# Altium project Li-IonBatteryManager.PrjPcb
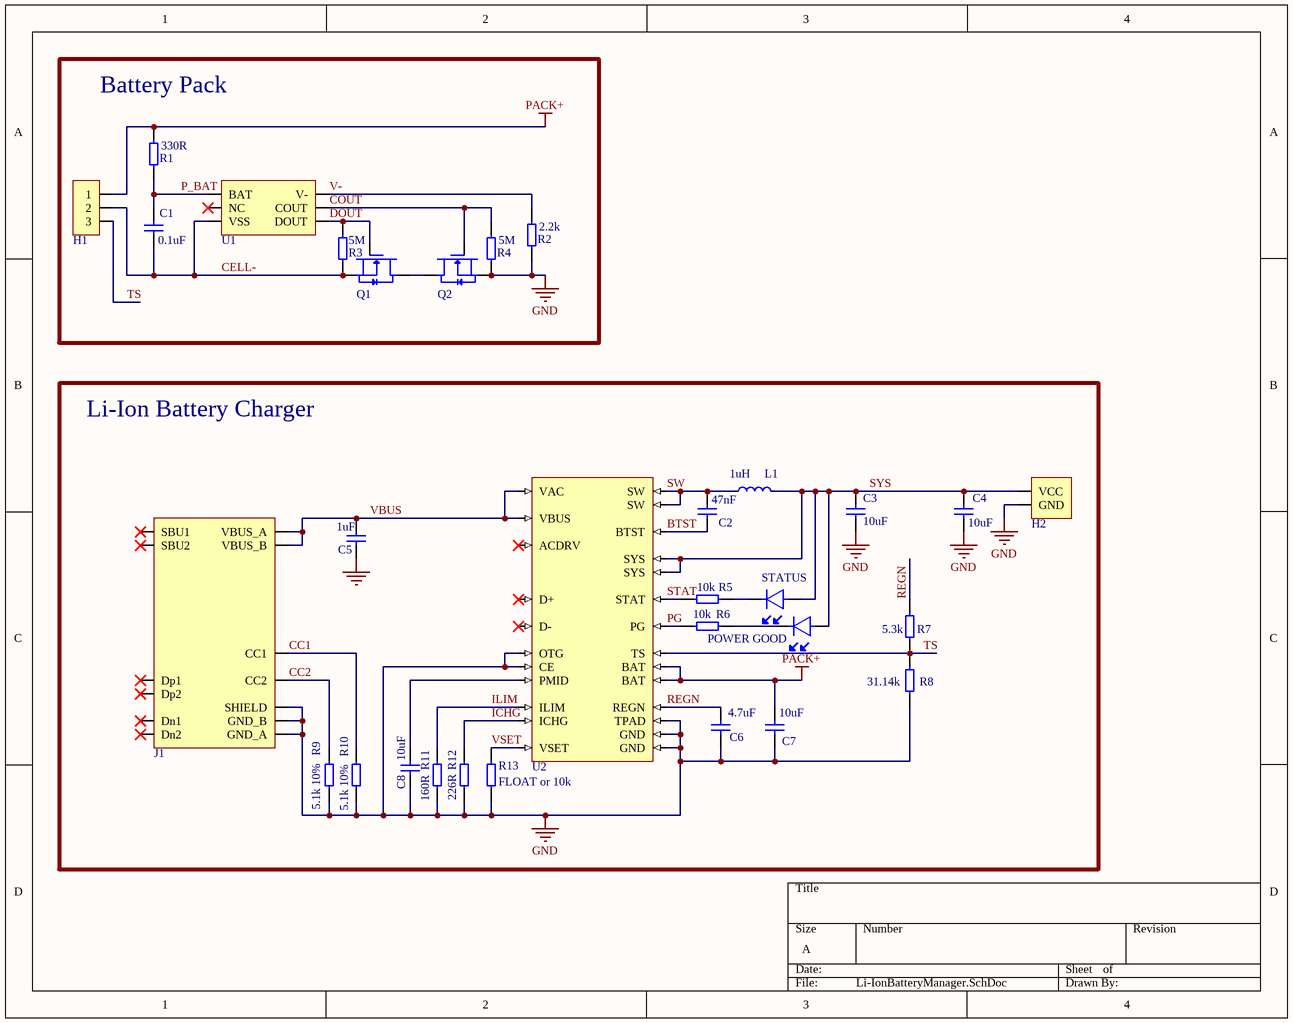
[diagram p0: Li-IonBatteryManager.SchDoc]
1 sheet, 31 parts. Net scope: global (net labels, ports and power ports of the same name join across sheets).
Board file: Li-IonBatteryManager.PcbDoc

## Sheet Li-IonBatteryManager.SchDoc
size A; SheetNumber: 1; SheetTotal: 1

### Parts
C1  0.1uF  [0603 Capacitor]
C2  47nF  [0603 Capacitor]
C3  10uF  [0603 Capacitor]
C4  10uF  [0603 Capacitor]
C5  1uF  [0603 Capacitor]
C6  4.7uF  [0603 Capacitor]
C7  10uF  [0603 Capacitor]
C8  10uF  [0603 Capacitor]
D1  STATUS  [0603 LED]
D2  POWER GOOD  [0603 LED]
H1  22-05-7035  [Molex Header 3]  (value not drawn)
H2  Header 2x1  [HEADER 2x1]  (value not drawn)
J1  2137160001  [USB TYPE C Molex]  (value not drawn)
L1  1uH  [SRP2510A]
Q1  CSD16406Q3  [CSD16406Q3]  (value not drawn)
Q2  CSD16406Q3  [CSD16406Q3]  (value not drawn)
R1  330R  [0603 Resistor]
R2  2.2k  [0603 Resistor]
R3  5M  [0603 Resistor]
R4  5M  [0603 Resistor]
R5  10k  [0603 Resistor]
R6  10k  [0603 Resistor]
R7  5.3k  [0603 Resistor]
R8  31.14k  [0603 Resistor]
R9  5.1k 10%  [0603 Resistor]
R10  5.1k 10%  [0603 Resistor]
R11  160R  [0603 Resistor]
R12  226R  [0603 Resistor]
R13  FLOAT or 10k  [0603 Resistor]
U1  BQ29700DSET  [BQ297xx]  (value not drawn)
U2  BQ25616JRTWR  [BQ25616]  (value not drawn)

### Blocks framed on the sheet
Battery Pack: C1 H1 Q1 Q2 R1-R4 U1
Li-Ion Battery Charger: C2-C8 D1 D2 H2 J1 L1 R5-R13 U2

### Nets
GND: C3.1 C4.1 C5.1 C6.1 C7.1 C8.1 H2.2(GND) J1.A1(GND_A) J1.B1(GND_B) J1.SHIELD Q2.1 R2.1 R4.1 R8.1 R9.1 R10.1 R11.1 R12.1 R13.1 U2.6(OTG) U2.9(CE) U2.17(GND) U2.18(GND) U2.25(TPAD)
PACK+: C7.2 H1.1 R1.2 U2.13(BAT) U2.14(BAT)
BTST: C2.1 U2.21(BTST)
CC1: J1.A5(CC1) R10.2
CC2: J1.B5(CC2) R9.2
CELL-: C1.1 H1.2 Q1.1 R3.1 U1.4(VSS)
COUT: Q2.4 R4.2 U1.2(COUT)
DOUT: Q1.4 R3.2 U1.3(DOUT)
ICHG: R12.2 U2.10(ICHG)
ILIM: R11.2 U2.8(ILIM)
P_BAT: C1.2 R1.1 U1.5(BAT)
PG: R6.1 U2.7(PG)
REGN: C6.2 R7.2 U2.22(REGN)
STAT: R5.1 U2.5(STAT)
SW: C2.2 L1.1 U2.19(SW) U2.20(SW)
SYS: C3.2 C4.2 D1.1 D2.1 H2.1(VCC) L1.2 U2.15(SYS) U2.16(SYS)
TS: H1.3 R7.1 R8.2 U2.11(TS)
V-: R2.2 U1.6(V-)
VBUS: C5.2 J1.A4(VBUS_A) J1.B4(VBUS_B) U2.1(VAC) U2.24(VBUS)
VSET: R13.2 U2.12(VSET)
NetC8_2: C8.2 U2.23(PMID)
NetD1_2: D1.2 R5.2
NetD2_2: D2.2 R6.2
NetQ1_5: Q1.5 Q2.5

Not connected (* = marked no-connect by the designer): J1 A6(Dp1)* A7(Dn1)* A8(SBU1)* B6(Dp2)* B7(Dn2)* B8(SBU2)*; U1 1(NC)*; U2 2(ACDRV)* 3(D+)* 4(D-)*

### Library data of the parts
C1-C8 = Capacitor
D1 D2 = LED
H1 = 22-05-7035: Header 2.5mm SPOX,  WTB,  RA,  F/lock,  3w; Manufacturer 1: Molex; Voltage Rating: 250V; Current Rating: 3A; Gender: Male; Contact Resistance: 20mR; Number of Positions: 3; Max Voltage Rating (DC): 250.25kV; Insulation Resistance: 1GR; Shrouded: Yes (With); Test Voltage: 1kV; Glow Wire Compliant: Non-compliant; Supplier 1: Digi-Key; Supplier Part Number 1: WM18901-ND; Manufacturer Part Number 1: 22-05-7035; RoHS: Yes; Category: Headers and Wire Housings; Stock 1: 4209; Pricing 1: 1=0.26000, 10=0.20600, 100=0.14770, 1000=0.11562, 5000=0.10278, 10000=0.09314 (USD); Mount: Through Hole; Contact Plating: Tin,Copper; Contact Material: Brass; Housing Color: Natural; Color: Natural; Housing Material: Nylon; Contact Shape: Circular; Contact Finish - Mating: TIN; Insulation Material: Nylon; Insulation Color: Natural; Min Operating Temperature: -40°C; Max Operating Temperature: 105°C; Package Quantity: 20000; Packaging: Bulk; Termination: Solder; Number of Rows: 1; Number of Contacts: 3; Orientation: Right Angle; Voltage Rating (DC): 250V; Number of Circuits: 3; Contact Gender: Male; Connector Type: Header; Max Voltage Rating (AC): 250V; Number of Poles: 3; Max Current Rating: 3A; Fastening Type: Detent; Series: Mini-SPOX 5268; Contact Type: Male Pin; Length: 9.9mm; Height: 4.9mm; Pitch: 2.5mm; Depth: 7.9mm; Radiation Hardening: No; REACH SVHC: Unknown; Lead Free: Lead Free; RoHS Compliant: Yes; Flammability Rating: UL94 V-0; ComponentLink1URL: https://datasheet.ciiva.com/30128/225440022057035-pcb-headers-30128301.pdf?src-supplier=Onlinecomponents.com; ComponentLink1Description: https://datasheet.ciiva.com/30128/225440022057035-pcb-headers-30128301.pdf?src-supplier=Onlinecomponents.com; ComponentLink2URL: https://datasheet.ciiva.com/11746/0900766b80da772d-11746287.pdf?src-supplier=RSComponents; ComponentLink2Description: https://datasheet.ciiva.com/11746/0900766b80da772d-11746287.pdf?src-supplier=RSComponents; ComponentLink3URL: https://datasheet.ciiva.com/5153/0022057035-pcb-headers-158546-5153221.pdf?src-supplier=Mouser; ComponentLink3Description: https://datasheet.ciiva.com/5153/0022057035-pcb-headers-158546-5153221.pdf?src-supplier=Mouser; ComponentLink4URL: https://datasheet.ciiva.com/19461/1965939-19461711.pdf?src-supplier=Jameco; ComponentLink4Description: https://datasheet.ciiva.com/19461/1965939-19461711.pdf?src-supplier=Jameco; ComponentLink5URL: https://datasheet.ciiva.com/7167/1869086-7167685.pdf?src-supplier=Newark; ComponentLink5Description: https://datasheet.ciiva.com/7167/1869086-7167685.pdf?src-supplier=Newark
J1 = 2137160001: Type C Receptacle DIP 16PIN; Manufacturer 1: Molex; Supplier 1: Digi-Key; Supplier Part Number 1: 900-2137160001CT-ND; Manufacturer Part Number 1: 2137160001; Stock 1: 7827; Pricing 1: 1=1.05000, 10=0.87100, 100=0.72600 (USD)
L1 = SRP2510A-1R0M: BOURNS - SRP2510A-1R0M - INDUCTOR, 1UH, 3A, 20%, SHIELDED; Core Material: Ferrite; Saturation Current: 3.5A; DC Resistance (DCR): 54mR; Self Resonant Frequency: 94MHz; Test Frequency: 1MHz; Supplier 1: Digi-Key; Supplier Part Number 1: SRP2510A-1R0MCT-ND; Manufacturer 1: Bourns; Manufacturer Part Number 1: SRP2510A-1R0M; RoHS: Yes; Category: Fixed Inductors; Stock 1: 5280; Pricing 1: 1=0.53000, 10=0.46200, 25=0.42880, 50=0.36300, 100=0.33000, 250=0.31020, 500=0.27720, 1000=0.22440 (USD); Mount: Surface Mount; Case/Package: 1008; Case Code (Imperial): 1008; Case Code (Metric): 2520; Min Operating Temperature: -40°C; Max Operating Temperature: 125°C; Resistor Type: Wirewound; Packaging: Cut Tape; Inductance: 1uH; Tolerance: 20%; Current Rating: 3A; Shielding: Shielded; Ratings: AEC-Q200; RoHS Compliant: Yes; ComponentLink1URL: http://www.farnell.com/datasheets/2330876.pdf?src-supplier=Farnell; ComponentLink1Description: http://www.farnell.com/datasheets/2330876.pdf?src-supplier=Farnell; ComponentLink2URL: http://www.farnell.com/datasheets/2330876.pdf?src-supplier=Newark; ComponentLink2Description: http://www.farnell.com/datasheets/2330876.pdf?src-supplier=Newark; ComponentLink3URL: https://www.bourns.com/docs/Product-Datasheets/srp2510a.pdf?src-supplier=Digi-Key; ComponentLink3Description: https://www.bourns.com/docs/Product-Datasheets/srp2510a.pdf?src-supplier=Digi-Key
Q1 Q2 = CSD16406Q3: TEXAS INSTRUMENTS - CSD16406Q3 - N CHANNEL MOSFET, 25V, 60A, SON; Rise Time: 12.9ns; Rds On Max: 5.3mR; Input Capacitance: 1.1nF; Nominal Vgs: 1.7V; Max Power Dissipation: 2.7W; Fall Time: 4.8ns; Turn-Off Delay Time: 8.5ns; Gate to Source Voltage (Vgs): 16V; Turn-On Delay Time: 7.3ns; Number of Elements: 1; Element Configuration: Single; Polarity: N-CHANNEL; Supplier 1: Digi-Key; Supplier Part Number 1: 296-24251-1-ND; Manufacturer 1: Texas Instruments; Manufacturer Part Number 1: CSD16406Q3; RoHS: Yes; Category: MOSFETs; Stock 1: 13974; Pricing 1: 1=1.17000, 10=0.95900, 25=0.94160, 100=0.74610, 500=0.63244, 1000=0.51518 (USD); Mount: Surface Mount; Case/Package: SON; Number of Pins: 8; Contact Plating: Tin,Matte; Min Operating Temperature: -55°C; Max Operating Temperature: 150°C; Packaging: Tape and Reel; Package Quantity: 1; Dual Supply Voltage: 25V; Drain to Source Voltage (Vdss): 25V; Continuous Drain Current (ID): 60A; Drain to Source Breakdown Voltage: 25V; Power Dissipation: 2.7W; Termination: SMD/SMT; Threshold Voltage: 1.7V; Series: NexFET™; Radiation Hardening: No; REACH SVHC: No SVHC; Lead Free: Contains Lead; RoHS Compliant: Yes; ComponentLink1URL: https://datasheet.ciiva.com/14192/slps202a-14192882.pdf?src-supplier=Avnet; ComponentLink1Description: https://datasheet.ciiva.com/14192/slps202a-14192882.pdf?src-supplier=Avnet; ComponentLink2URL: https://datasheet.ciiva.com/6387/csd16406q3-6387192.pdf?src-supplier=Digi-Key; ComponentLink2Description: https://datasheet.ciiva.com/6387/csd16406q3-6387192.pdf?src-supplier=Digi-Key; ComponentLink3URL: https://datasheet.ciiva.com/4438/slps202a-128073-4438442.pdf?src-supplier=Mouser; ComponentLink3Description: https://datasheet.ciiva.com/4438/slps202a-128073-4438442.pdf?src-supplier=Mouser; ComponentLink4URL: https://datasheet.ciiva.com/1255/csd16406q3-1255292.pdf?src-supplier=Newark; ComponentLink4Description: https://datasheet.ciiva.com/1255/csd16406q3-1255292.pdf?src-supplier=Newark; ComponentLink5URL: https://datasheet.ciiva.com/5832/483980-5832634.pdf?src-supplier=Farnell; ComponentLink5Description: https://datasheet.ciiva.com/5832/483980-5832634.pdf?src-supplier=Farnell; ComponentLink6URL: https://datasheet.ciiva.com/5832/483980-5832635.pdf?src-supplier=Farnell; ComponentLink6Description: https://datasheet.ciiva.com/5832/483980-5832635.pdf?src-supplier=Farnell; ComponentLink7URL: https://datasheet.ciiva.com/7643/1389665-7643292.pdf?src-supplier=Element14; ComponentLink7Description: https://datasheet.ciiva.com/7643/1389665-7643292.pdf?src-supplier=Element14; ComponentLink8URL: https://datasheet.ciiva.com/14423/slps202a-14423477.pdf?src-supplier=Avnet; ComponentLink8Description: https://datasheet.ciiva.com/14423/slps202a-14423477.pdf?src-supplier=Avnet; ComponentLink9URL: https://datasheet.ciiva.com/6387/csd16406q3-6387195.pdf?src-supplier=Digi-Key; ComponentLink9Description: https://datasheet.ciiva.com/6387/csd16406q3-6387195.pdf?src-supplier=Digi-Key; ComponentLink10URL: https://datasheet.ciiva.com/6387/csd16406q3-6387198.pdf?src-supplier=Digi-Key; ComponentLink10Description: https://datasheet.ciiva.com/6387/csd16406q3-6387198.pdf?src-supplier=Digi-Key
R1-R13 = Resistor
U1 = BQ29700DSET: Li-Ion/Li Polymer Advanced Single-Cell Battery Protector IC Family 6-WSON -40 to 85; Manufacturer 1: Texas Instruments; Number of Batteries: 1; Min Supply Voltage: 1.5V; Max Supply Voltage: 8V; Output Voltage: 28V; Output Current: 5.5uA; Operating Supply Current: 4uA; Fault Protection: Over Current,Short Circuit,Over/Under Voltage; Supplier 1: Digi-Key; Supplier Part Number 1: 296-37746-1-ND; Manufacturer Part Number 1: BQ29700DSET; RoHS: Yes; Category: Battery Management; Stock 1: 86; Pricing 1: 1=0.69000, 10=0.60500, 25=0.56840, 100=0.43090 (USD); Mount: Surface Mount; Case/Package: WFDFN; Number of Pins: 6; Weight: 0.000342oz; Contact Plating: Gold; Min Operating Temperature: -40°C; Max Operating Temperature: 85°C; Packaging: Tape and Reel; Number of Cells: 1; Max Output Voltage: 8V; Package Quantity: 250; Length: 1.55mm; Width: 1.55mm; Height: 0.8mm; Radiation Hardening: No; REACH SVHC: No SVHC; Lead Free: Lead Free; RoHS Compliant: Yes; ComponentLink1URL: 2; ComponentLink1Description: https://datasheet.ciiva.com/46402/1817247-46402997.pdf?src-supplier=Element14
U2 = BQ25616JRTWR: Manufacturer 1: Texas Instruments; Supplier 1: Digi-Key; Supplier Part Number 1: 296-BQ25616JRTWRCT-ND; Manufacturer Part Number 1: BQ25616JRTWR; RoHS: Yes; Category: Battery Management; Stock 1: 553; Pricing 1: 1=3.10000, 10=2.78100, 25=2.62360, 100=2.23520, 250=2.09880, 500=1.83644, 1000=1.65330 (USD)